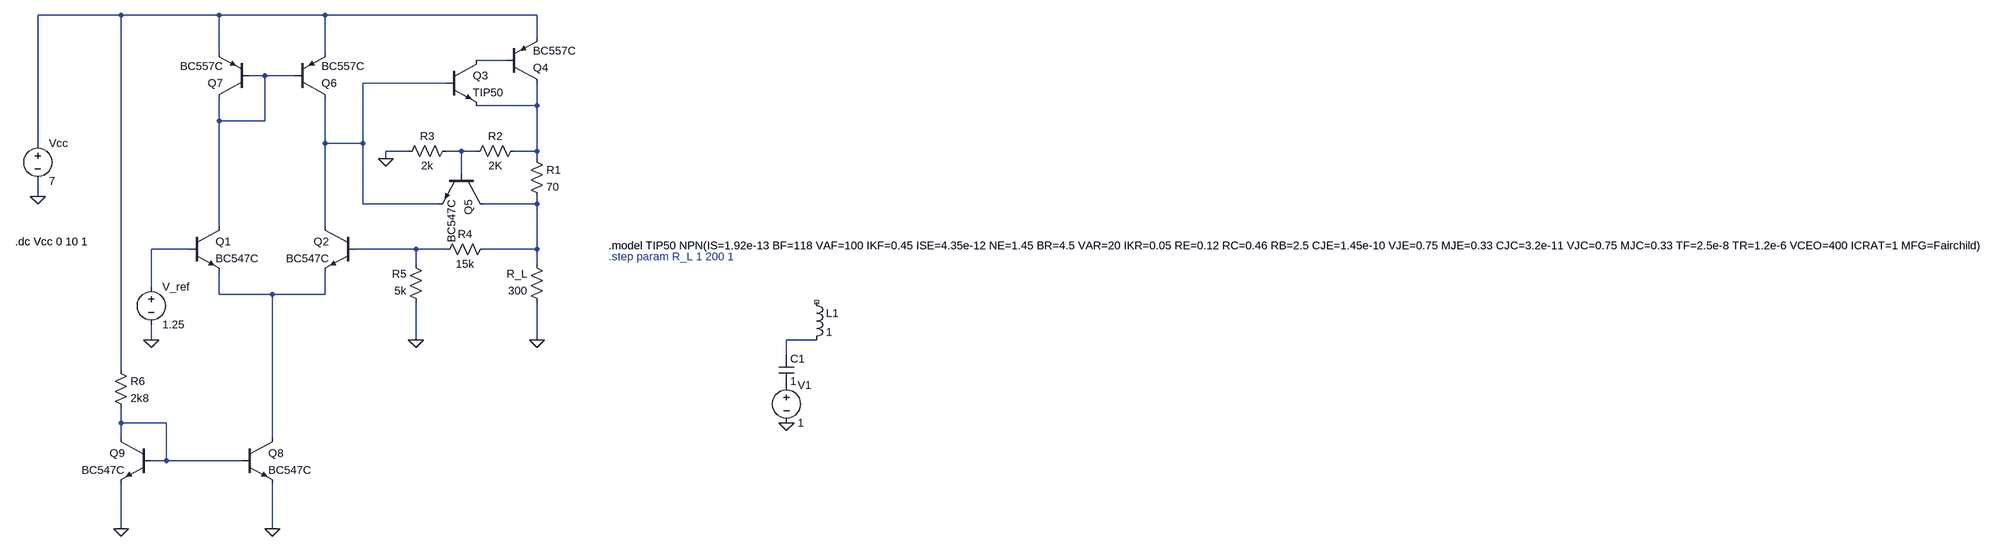
[diagram p0: schematic LDO_v1.asc]
LDO_v1.asc, the LTspice schematic file:
Version 4.1
SHEET 1 3988 868
WIRE -144 -320 -320 -320
WIRE 64 -320 -144 -320
WIRE 288 -320 64 -320
WIRE 736 -320 288 -320
WIRE 736 -272 736 -320
WIRE 64 -240 64 -320
WIRE 288 -240 288 -320
WIRE 672 -224 608 -224
WIRE 160 -192 128 -192
WIRE 224 -192 160 -192
WIRE 544 -176 368 -176
WIRE 736 -128 736 -176
WIRE 736 -128 608 -128
WIRE 64 -96 64 -144
WIRE 160 -96 160 -192
WIRE 160 -96 64 -96
WIRE -320 -48 -320 -320
WIRE 288 -48 288 -144
WIRE 368 -48 368 -176
WIRE 368 -48 288 -48
WIRE 464 -32 416 -32
WIRE 576 -32 544 -32
WIRE 608 -32 576 -32
WIRE 736 -32 736 -128
WIRE 736 -32 688 -32
WIRE 416 -16 416 -32
WIRE 736 -16 736 -32
WIRE 576 16 576 -32
WIRE -320 64 -320 32
WIRE 368 80 368 -48
WIRE 528 80 368 80
WIRE 736 80 736 64
WIRE 736 80 624 80
WIRE 64 128 64 -96
WIRE 288 128 288 -48
WIRE 0 176 -80 176
WIRE 480 176 352 176
WIRE 544 176 480 176
WIRE 736 176 736 80
WIRE 736 176 624 176
WIRE 480 208 480 176
WIRE 736 208 736 176
WIRE -80 256 -80 176
WIRE 64 272 64 224
WIRE 176 272 64 272
WIRE 288 272 288 224
WIRE 288 272 176 272
WIRE -80 368 -80 336
WIRE 480 368 480 288
WIRE 736 368 736 288
WIRE 1328 368 1264 368
WIRE 1264 400 1264 368
WIRE -144 432 -144 -320
WIRE -144 544 -144 512
WIRE -48 544 -144 544
WIRE -144 576 -144 544
WIRE 176 576 176 272
WIRE -48 624 -48 544
WIRE -48 624 -80 624
WIRE 112 624 -48 624
WIRE -144 768 -144 672
WIRE 176 768 176 672
FLAG 416 -16 0
FLAG 480 368 0
FLAG 736 368 0
FLAG -320 64 0
FLAG -80 368 0
FLAG 1264 544 0
FLAG 176 768 0
FLAG -144 768 0
SYMBOL npn 0 128 R0
SYMATTR InstName Q1
SYMATTR Value BC547C
SYMBOL npn 352 128 M0
SYMATTR InstName Q2
SYMATTR Value BC547C
SYMBOL npn 544 -224 R0
SYMATTR InstName Q3
SYMATTR Value TIP50
SYMBOL res 720 -32 R0
SYMATTR InstName R1
SYMATTR Value 70
SYMBOL res 704 -48 R90
WINDOW 0 0 56 VBottom 2
WINDOW 3 32 56 VTop 2
SYMATTR InstName R2
SYMATTR Value 2K
SYMBOL res 560 -48 R90
WINDOW 0 0 56 VBottom 2
WINDOW 3 32 56 VTop 2
SYMATTR InstName R3
SYMATTR Value 2k
SYMBOL res 640 160 R90
WINDOW 0 0 56 VBottom 2
WINDOW 3 32 56 VTop 2
SYMATTR InstName R4
SYMATTR Value 15k
SYMBOL res 496 304 R180
WINDOW 0 36 76 Left 2
WINDOW 3 36 40 Left 2
SYMATTR InstName R5
SYMATTR Value 5k
SYMBOL res 752 304 R180
WINDOW 0 36 76 Left 2
WINDOW 3 36 40 Left 2
SYMATTR InstName R_L
SYMATTR Value 300
SYMBOL voltage -80 240 R0
SYMATTR InstName V_ref
SYMATTR Value 1.25
SYMBOL voltage -320 -64 R0
SYMATTR InstName Vcc
SYMATTR Value 7
SYMBOL ind 1312 272 R0
SYMATTR InstName L1
SYMATTR Value 1
SYMBOL cap 1248 400 R0
SYMATTR InstName C1
SYMATTR Value 1
SYMBOL voltage 1264 448 R0
SYMATTR InstName V1
SYMATTR Value 1
SYMBOL pnp 224 -144 M180
SYMATTR InstName Q6
SYMATTR Value BC557C
SYMBOL pnp 128 -144 R180
SYMATTR InstName Q7
SYMATTR Value BC557C
SYMBOL res -160 416 R0
SYMATTR InstName R6
SYMATTR Value 2k8
SYMBOL npn 112 576 R0
SYMATTR InstName Q8
SYMATTR Value BC547C
SYMBOL npn -80 576 M0
SYMATTR InstName Q9
SYMATTR Value BC547C
SYMBOL npn 624 16 R90
SYMATTR InstName Q5
SYMATTR Value BC547C
SYMBOL pnp 672 -176 M180
SYMATTR InstName Q4
SYMATTR Value BC557C
TEXT -368 160 Left 2 !.dc Vcc 0 10 1
TEXT 888 192 Left 2 ;.step param R_L 1 200 1
TEXT 888 168 Left 2 !.model TIP50 NPN(IS=1.92e-13 BF=118 VAF=100 IKF=0.45 ISE=4.35e-12 NE=1.45 BR=4.5 VAR=20 IKR=0.05 RE=0.12 RC=0.46 RB=2.5 CJE=1.45e-10 VJE=0.75 MJE=0.33 CJC=3.2e-11 VJC=0.75 MJC=0.33 TF=2.5e-8 TR=1.2e-6 VCEO=400 ICRAT=1 MFG=Fairchild)

The netlist it stands for:
* LDO_v1.asc
Q1 N003 N008 N010 0 BC547C
Q2 N004 N009 N010 0 BC547C
Q3 N002 N004 N005 0 TIP50
R1 N005 N007 70
R2 N005 N006 2K
R3 N006 0 2k
R4 N007 N009 15k
R5 0 N009 5k
R_L 0 N007 300
V_ref N008 0 1.25
Vcc N001 0 7
L1 NC_01 N011 1
C1 N011 P001 1
V1 P001 0 1
Q6 N004 N003 N001 0 BC557C
Q7 N003 N003 N001 0 BC557C
R6 N001 N012 2k8
Q8 N010 N012 0 0 BC547C
Q9 N012 N012 0 0 BC547C
Q5 N007 N006 N004 0 BC547C
Q4 N005 N002 N001 0 BC557C
.model NPN NPN
.model PNP PNP
.lib standard.bjt
.dc Vcc 0 10 1
* .step param R_L 1 200 1
.model TIP50 NPN(IS=1.92e-13 BF=118 VAF=100 IKF=0.45 ISE=4.35e-12 NE=1.45 BR=4.5 VAR=20 IKR=0.05 RE=0.12 RC=0.46 RB=2.5 CJE=1.45e-10 VJE=0.75 MJE=0.33 CJC=3.2e-11 VJC=0.75 MJC=0.33 TF=2.5e-8 TR=1.2e-6 VCEO=400 ICRAT=1 MFG=Fairchild)
.backanno
.end